# EasyEDA Pro project ProDocument_frontend_2024-01-22.epro

# Schematic Schematic2
Create Date: 2023-08-02; Page Name: P1; Project Name: esp-alarm-clock; Schematic Name: Schematic2; Update Date: 2023-08-02; Company: EasyEDA.com; Drawed: EasyEDA Pro; Page Size: A4; Part Number: JLCPCB-002; Reviewed: EasyEDA Pro; Version: V0.1
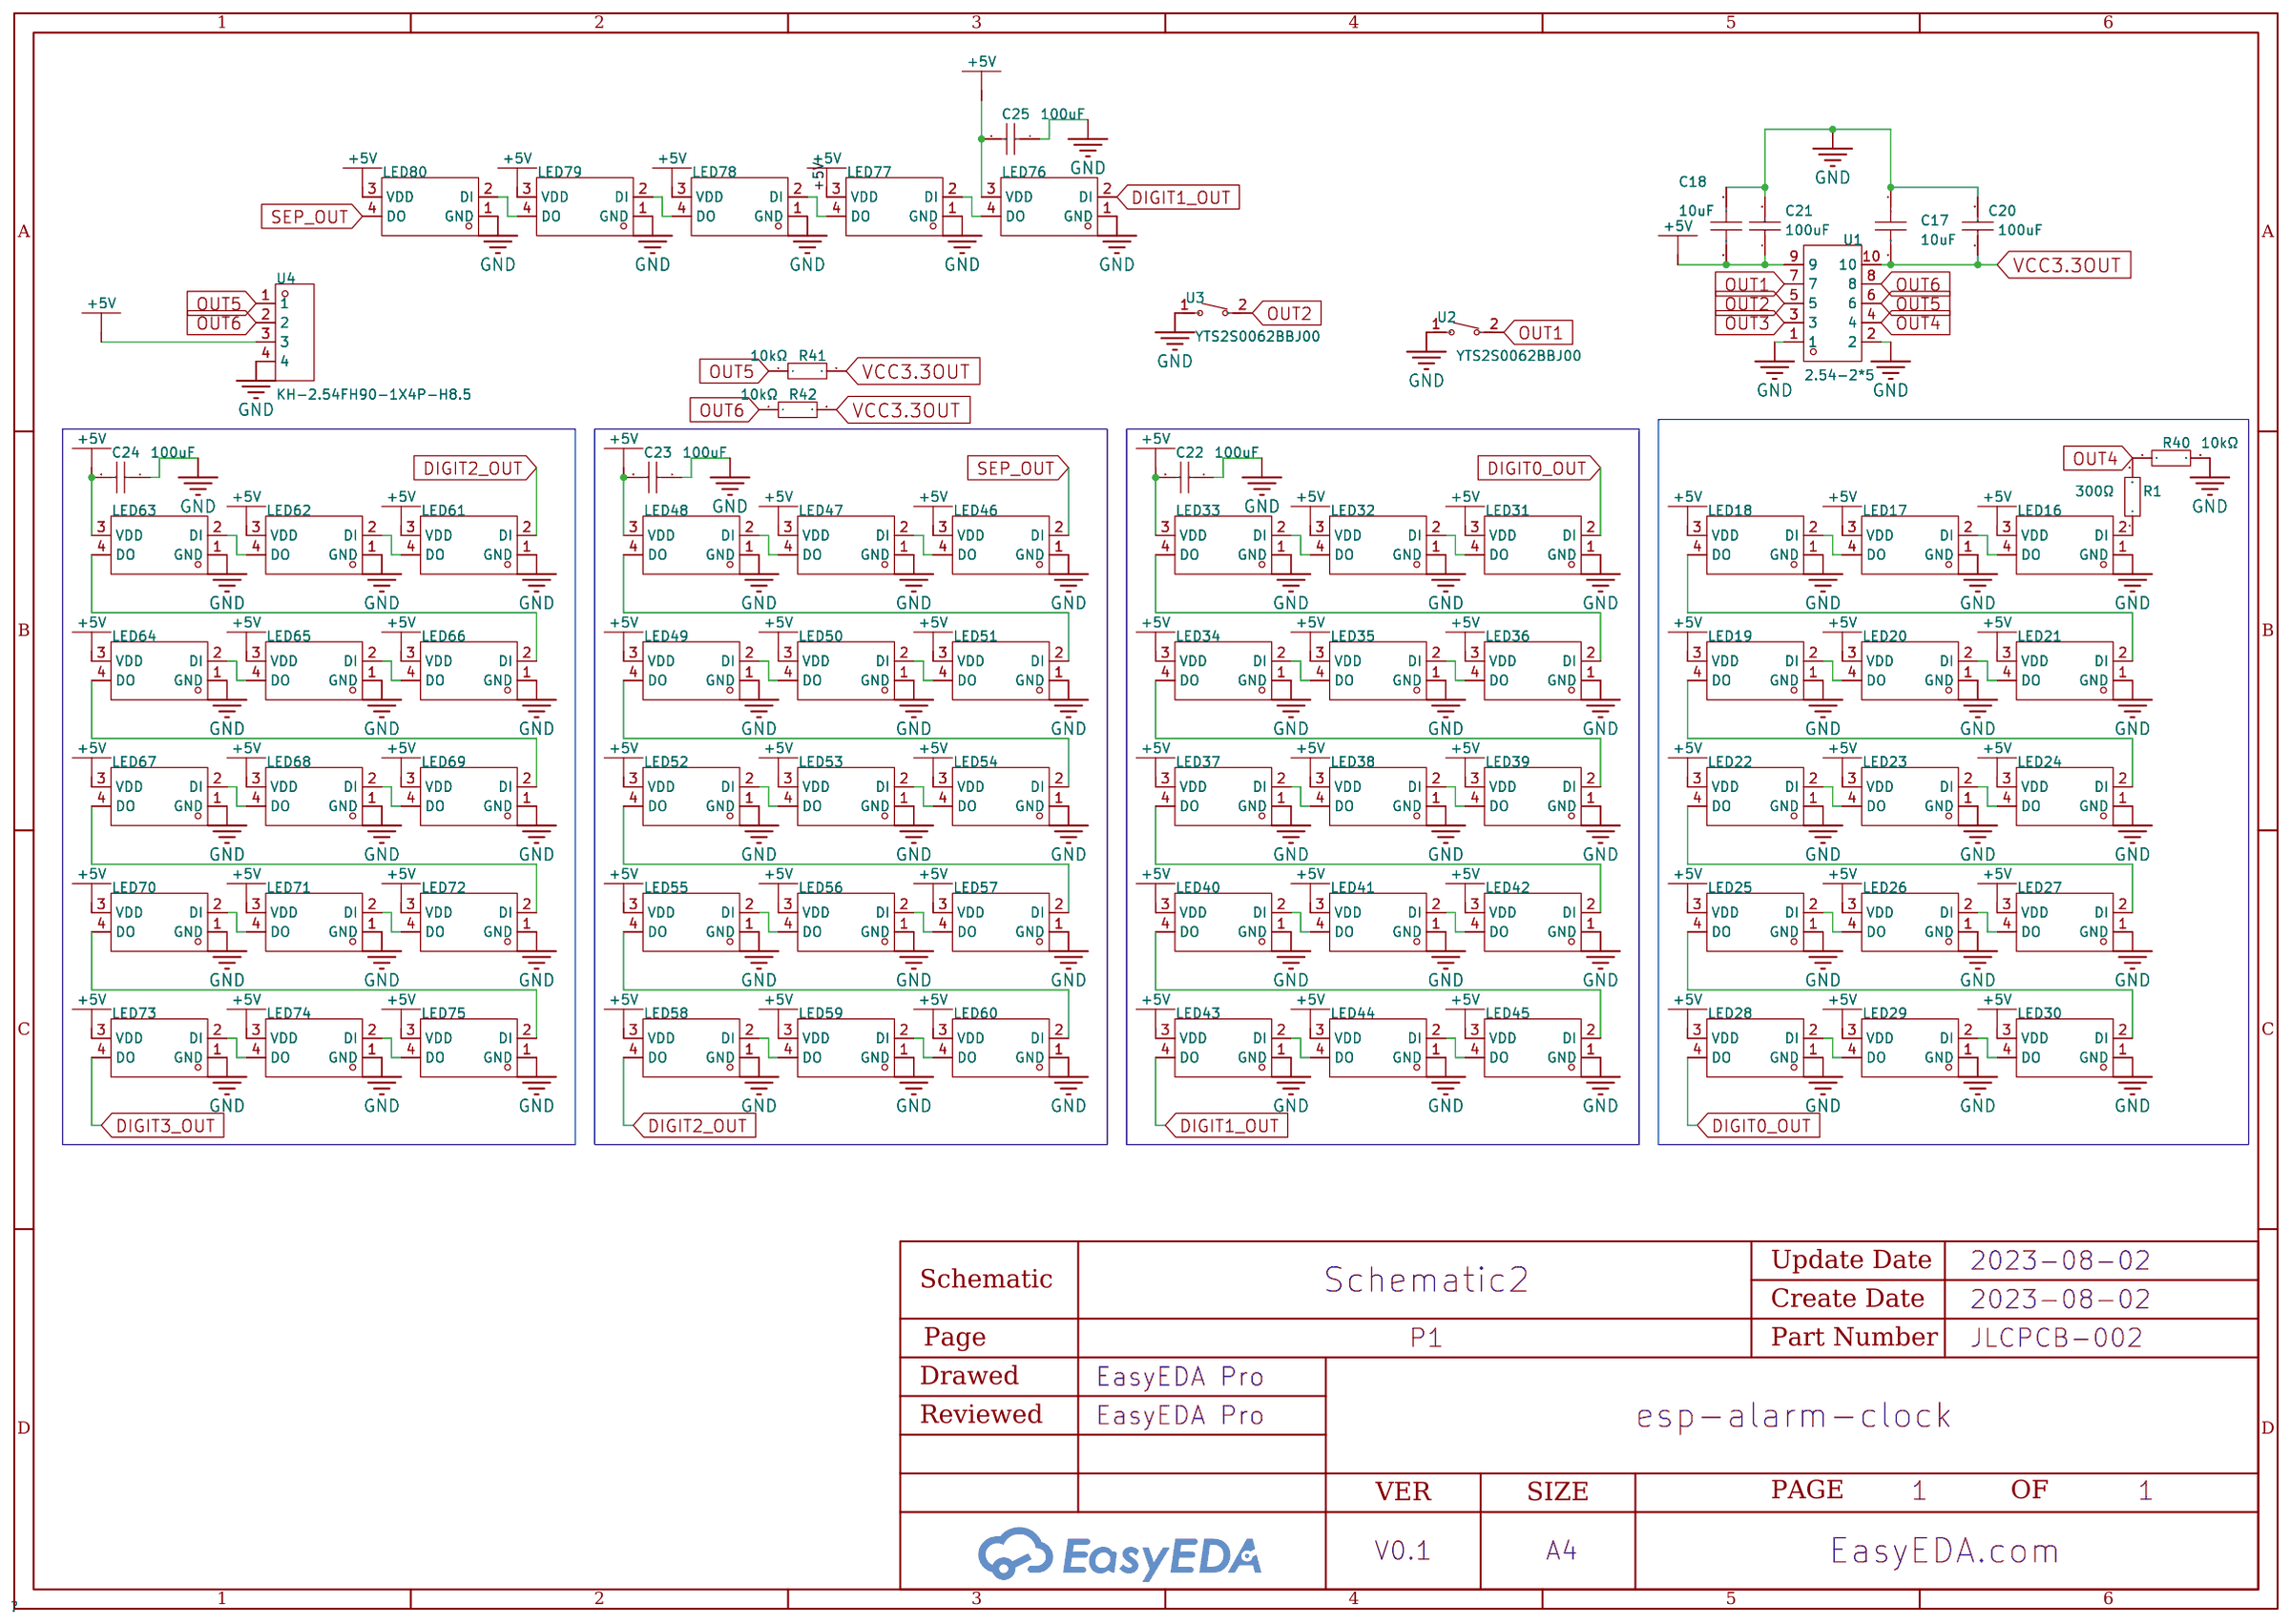
[diagram p0: schematic sheet]

## Parts
C17  10uF  [C0603]
C18  10uF  [C0603]
C20  100uF  [C1206]
C21  100uF  [C1206]
C22  100uF  [C1206]
C23  100uF  [C1206]
C24  100uF  [C1206]
C25  100uF  [C1206]
LED16  XL-3528RGBW-WS2812B  [LED-SMD_4P-L3.5-W2.8-BR-1]
LED17  XL-3528RGBW-WS2812B  [LED-SMD_4P-L3.5-W2.8-BR-1]
LED18  XL-3528RGBW-WS2812B  [LED-SMD_4P-L3.5-W2.8-BR-1]
LED19  XL-3528RGBW-WS2812B  [LED-SMD_4P-L3.5-W2.8-BR-1]
LED20  XL-3528RGBW-WS2812B  [LED-SMD_4P-L3.5-W2.8-BR-1]
LED21  XL-3528RGBW-WS2812B  [LED-SMD_4P-L3.5-W2.8-BR-1]
LED22  XL-3528RGBW-WS2812B  [LED-SMD_4P-L3.5-W2.8-BR-1]
LED23  XL-3528RGBW-WS2812B  [LED-SMD_4P-L3.5-W2.8-BR-1]
LED24  XL-3528RGBW-WS2812B  [LED-SMD_4P-L3.5-W2.8-BR-1]
LED25  XL-3528RGBW-WS2812B  [LED-SMD_4P-L3.5-W2.8-BR-1]
LED26  XL-3528RGBW-WS2812B  [LED-SMD_4P-L3.5-W2.8-BR-1]
LED27  XL-3528RGBW-WS2812B  [LED-SMD_4P-L3.5-W2.8-BR-1]
LED28  XL-3528RGBW-WS2812B  [LED-SMD_4P-L3.5-W2.8-BR-1]
LED29  XL-3528RGBW-WS2812B  [LED-SMD_4P-L3.5-W2.8-BR-1]
LED30  XL-3528RGBW-WS2812B  [LED-SMD_4P-L3.5-W2.8-BR-1]
LED31  XL-3528RGBW-WS2812B  [LED-SMD_4P-L3.5-W2.8-BR-1]
LED32  XL-3528RGBW-WS2812B  [LED-SMD_4P-L3.5-W2.8-BR-1]
LED33  XL-3528RGBW-WS2812B  [LED-SMD_4P-L3.5-W2.8-BR-1]
LED34  XL-3528RGBW-WS2812B  [LED-SMD_4P-L3.5-W2.8-BR-1]
LED35  XL-3528RGBW-WS2812B  [LED-SMD_4P-L3.5-W2.8-BR-1]
LED36  XL-3528RGBW-WS2812B  [LED-SMD_4P-L3.5-W2.8-BR-1]
LED37  XL-3528RGBW-WS2812B  [LED-SMD_4P-L3.5-W2.8-BR-1]
LED38  XL-3528RGBW-WS2812B  [LED-SMD_4P-L3.5-W2.8-BR-1]
LED39  XL-3528RGBW-WS2812B  [LED-SMD_4P-L3.5-W2.8-BR-1]
LED40  XL-3528RGBW-WS2812B  [LED-SMD_4P-L3.5-W2.8-BR-1]
LED41  XL-3528RGBW-WS2812B  [LED-SMD_4P-L3.5-W2.8-BR-1]
LED42  XL-3528RGBW-WS2812B  [LED-SMD_4P-L3.5-W2.8-BR-1]
LED43  XL-3528RGBW-WS2812B  [LED-SMD_4P-L3.5-W2.8-BR-1]
LED44  XL-3528RGBW-WS2812B  [LED-SMD_4P-L3.5-W2.8-BR-1]
LED45  XL-3528RGBW-WS2812B  [LED-SMD_4P-L3.5-W2.8-BR-1]
LED46  XL-3528RGBW-WS2812B  [LED-SMD_4P-L3.5-W2.8-BR-1]
LED47  XL-3528RGBW-WS2812B  [LED-SMD_4P-L3.5-W2.8-BR-1]
LED48  XL-3528RGBW-WS2812B  [LED-SMD_4P-L3.5-W2.8-BR-1]
LED49  XL-3528RGBW-WS2812B  [LED-SMD_4P-L3.5-W2.8-BR-1]
LED50  XL-3528RGBW-WS2812B  [LED-SMD_4P-L3.5-W2.8-BR-1]
LED51  XL-3528RGBW-WS2812B  [LED-SMD_4P-L3.5-W2.8-BR-1]
LED52  XL-3528RGBW-WS2812B  [LED-SMD_4P-L3.5-W2.8-BR-1]
LED53  XL-3528RGBW-WS2812B  [LED-SMD_4P-L3.5-W2.8-BR-1]
LED54  XL-3528RGBW-WS2812B  [LED-SMD_4P-L3.5-W2.8-BR-1]
LED55  XL-3528RGBW-WS2812B  [LED-SMD_4P-L3.5-W2.8-BR-1]
LED56  XL-3528RGBW-WS2812B  [LED-SMD_4P-L3.5-W2.8-BR-1]
LED57  XL-3528RGBW-WS2812B  [LED-SMD_4P-L3.5-W2.8-BR-1]
LED58  XL-3528RGBW-WS2812B  [LED-SMD_4P-L3.5-W2.8-BR-1]
LED59  XL-3528RGBW-WS2812B  [LED-SMD_4P-L3.5-W2.8-BR-1]
LED60  XL-3528RGBW-WS2812B  [LED-SMD_4P-L3.5-W2.8-BR-1]
LED61  XL-3528RGBW-WS2812B  [LED-SMD_4P-L3.5-W2.8-BR-1]
LED62  XL-3528RGBW-WS2812B  [LED-SMD_4P-L3.5-W2.8-BR-1]
LED63  XL-3528RGBW-WS2812B  [LED-SMD_4P-L3.5-W2.8-BR-1]
LED64  XL-3528RGBW-WS2812B  [LED-SMD_4P-L3.5-W2.8-BR-1]
LED65  XL-3528RGBW-WS2812B  [LED-SMD_4P-L3.5-W2.8-BR-1]
LED66  XL-3528RGBW-WS2812B  [LED-SMD_4P-L3.5-W2.8-BR-1]
LED67  XL-3528RGBW-WS2812B  [LED-SMD_4P-L3.5-W2.8-BR-1]
LED68  XL-3528RGBW-WS2812B  [LED-SMD_4P-L3.5-W2.8-BR-1]
LED69  XL-3528RGBW-WS2812B  [LED-SMD_4P-L3.5-W2.8-BR-1]
LED70  XL-3528RGBW-WS2812B  [LED-SMD_4P-L3.5-W2.8-BR-1]
LED71  XL-3528RGBW-WS2812B  [LED-SMD_4P-L3.5-W2.8-BR-1]
LED72  XL-3528RGBW-WS2812B  [LED-SMD_4P-L3.5-W2.8-BR-1]
LED73  XL-3528RGBW-WS2812B  [LED-SMD_4P-L3.5-W2.8-BR-1]
LED74  XL-3528RGBW-WS2812B  [LED-SMD_4P-L3.5-W2.8-BR-1]
LED75  XL-3528RGBW-WS2812B  [LED-SMD_4P-L3.5-W2.8-BR-1]
LED76  XL-3528RGBW-WS2812B  [LED-SMD_4P-L3.5-W2.8-BR-1]
LED77  XL-3528RGBW-WS2812B  [LED-SMD_4P-L3.5-W2.8-BR-1]
LED78  XL-3528RGBW-WS2812B  [LED-SMD_4P-L3.5-W2.8-BR-1]
LED79  XL-3528RGBW-WS2812B  [LED-SMD_4P-L3.5-W2.8-BR-1]
LED80  XL-3528RGBW-WS2812B  [LED-SMD_4P-L3.5-W2.8-BR-1]
R1  300Ω  [R0603]
R40  10kΩ  [R0603]
R41  10kΩ  [R0603]
R42  10kΩ  [R0603]
U1  2.54-2*5  [HDR-TH_10P-P2.54-V-F-R2-C5-S2.54]
U2  YTS2S0062BBJ00  [KEY-SMD_L6.0-W6.0-LS6.6]
U3  YTS2S0062BBJ00  [KEY-SMD_L6.0-W6.0-LS6.6]
U4  KH-2.54FH90-1X4P-H8.5  [HDR-TH_4P-P2.54-H-F-W10.2]

## Library data of the parts
C17 C18 = TCC0603X5R106M6R3CT: Capacitance: Tolerance: Tolerance: Voltage Rated: Temperature Coefficient:; LCSC Part Name: 10uF ±20% 6.3V; Supplier Part: C380318; Manufacturer: CCTC(三环); Supplier Footprint: 0603; JLCPCB Part Class: Extended Part; Datasheet: https://atta.szlcsc.com/upload/public/pdf/source/20190322/C380318_4888396533DC2EE276525D3FA01190AE.pdf; Supplier: LCSC
C20-C25 = CL31A107MQHNNNE: Capacitance: Tolerance:±20% Tolerance:±20% Voltage Rated: Temperature Coefficient:; LCSC Part Name: 100uF ±20% 6.3V; Supplier Part: C15008; Manufacturer: SAMSUNG(三星); Supplier Footprint: 1206; JLCPCB Part Class: Basic Part; Datasheet: https://atta.szlcsc.com/upload/public/pdf/source/20160103/1457707673200.pdf; Supplier: LCSC; Tolerance: ±20%
LED16-LED80 = XL-3528RGBW-WS2812B: Emitted Color:RGB Diode Configuration:- Dominant Wavelength:618nm~623nm；520nm~525nm；467nm~472nm Dominant Wavelength:618nm~623nm；520nm~525nm；467nm~472nm Peak Wavelength:525nm；623nm；472nm Forward Current:20mA Power Dissipation:50mW；50mW；45mW Viewing Angle:1; LCSC Part Name: RGB三色 正贴 幻彩; Supplier Part: C2890364; Manufacturer: XINGLIGHT(成兴光); Supplier Footprint: SMD3528-4P; JLCPCB Part Class: Extended Part; Datasheet: https://atta.szlcsc.com/upload/public/pdf/source/20221102/50F456983F591359B0D81AA557777463.pdf; Supplier: LCSC; Emitted Color: RGB; Dominant Wavelength: 618nm~623nm；520nm~525nm；467nm~472nm; Peak Wavelength: 525nm；623nm；472nm; Forward Current: 20mA; Power Dissipation: 50mW；50mW；45mW; Viewing Angle: 120°; Mounting Sytle: Positive post; Operating Temperature: -25℃~+80℃
R1 = 0603WAF3000T5E: Type:Thick Film Resistors Resistance: Tolerance:±1% Tolerance:±1% Power(Watts): Temperature Coefficient:±100ppm/℃ Temperature Coefficient:±100ppm/℃ Overload Voltage (Max): Operating Temperature Range:-55℃~+155℃ Operating Temperature Range:-55℃~+155℃; LCSC Part Name: 300Ω ±1% 100mW; Supplier Part: C23025; Manufacturer: UNI-ROYAL(厚声); Supplier Footprint: 0603; JLCPCB Part Class: Basic Part; Datasheet: https://atta.szlcsc.com/upload/public/pdf/source/20200306/C422600_1E6D84923E4A46A82E41ADD87F860B5C.pdf; Supplier: LCSC; Type: Thick Film Resistors; Tolerance: ±1%; Temperature Coefficient: ±100ppm/℃; Operating Temperature Range: -55℃~+155℃
R40-R42 = RC0603FR-0710KL: Type:Thick Film Resistors Resistance: Tolerance:±1% Tolerance:±1% Power(Watts): Temperature Coefficient:±100ppm/℃ Temperature Coefficient:±100ppm/℃ Overload Voltage (Max): Operating Temperature Range:-55℃~+155℃ Operating Temperature Range:-55℃~+155℃; LCSC Part Name: 10kΩ ±1% 100mW; Supplier Part: C98220; Manufacturer: YAGEO(国巨); Supplier Footprint: 0603; JLCPCB Part Class: Extended Part; Datasheet: https://atta.szlcsc.com/upload/public/pdf/source/20170522/1495423494387.pdf; Supplier: LCSC; Type: Thick Film Resistors; Tolerance: ±1%; Temperature Coefficient: ±100ppm/℃; Operating Temperature Range: -55℃~+155℃
U1 = 2.54-2*5: Number of Rows:双排 Number of Holes:10 Pitch:2.54mm Holes Structure:2x5P Row Spacing:2.54mm Mounting Type:Straight Circular Hole / Square Hole:Square Holes Current Rating (Max):2.5A Voltage Rating (Max):- Holes Direction:Top Insulation Height:8.5mm Operatin; LCSC Part Name: 2.54mm 2x5P; Supplier Part: C2977587; Manufacturer: ZHOURI(洲日); Supplier Footprint: 插件,P=2.54mm; JLCPCB Part Class: Extended Part; Supplier: LCSC; Number of Rows: 双排; Number of Holes: 10; Pitch: 2.54mm; Holes Structure: 2x5P; Row Spacing: 2.54mm; Mounting Type: Straight; Circular Hole / Square Hole: Square Holes; Current Rating (Max): 2.5A; Holes Direction: Top; Insulation Height: 8.5mm; Operating Temperature Range: -40℃~+105℃
U2 U3 = YTS2S0062BBJ00: Operating Force:200gf Switch Length:6mm Switch Width:6mm Switch Height:5mm; LCSC Part Name: 6x6X5.0 200gf无声按键 轻触开关; Supplier Part: C5260485; Manufacturer: YIYUAN(怡远); Supplier Footprint: SMD; JLCPCB Part Class: Extended Part; Datasheet: https://atta.szlcsc.com/upload/public/pdf/source/20221115/9AA6C284B5850DDA84F65000856CABE8.pdf; Supplier: LCSC; Operating Force: 200gf; Switch Length: 6mm; Switch Width: 6mm; Switch Height: 5mm
U4 = KH-2.54FH90-1X4P-H8.5: Number of Rows:Plugin Number of Holes:4P Pitch:2.54mm Holes Structure:1x4P Row Spacing:- Mounting Type:Shrouded Circular Hole / Square Hole:Square Holes Current Rating (Max):3A Voltage Rating (Max):- Holes Direction:side Insulation Height:8.5mm Operating; LCSC Part Name: 2.54mm 1x4P; Supplier Part: C2932680; Manufacturer: kinghelm(金航标); Supplier Footprint: 弯插,P=2.54mm; JLCPCB Part Class: Extended Part; Datasheet: https://atta.szlcsc.com/upload/public/pdf/source/20211220/B697AF7E5D3EB74EDD88E765A3544EAB.pdf; Supplier: LCSC; Number of Rows: Plugin; Number of Holes: 4P; Pitch: 2.54mm; Holes Structure: 1x4P; Mounting Type: Shrouded; Circular Hole / Square Hole: Square Holes; Current Rating (Max): 3A; Holes Direction: side; Insulation Height: 8.5mm; Operating Temperature Range: -40℃~+105℃

## Nets
+5V: C18.2 C21.1 C22.2 C23.2 C24.2 C25.2 LED16.3(VDD) LED17.3(VDD) LED18.3(VDD) LED19.3(VDD) LED20.3(VDD) LED21.3(VDD) LED22.3(VDD) LED23.3(VDD) LED24.3(VDD) LED25.3(VDD) LED26.3(VDD) LED27.3(VDD) LED28.3(VDD) LED29.3(VDD) LED30.3(VDD) LED31.3(VDD) LED32.3(VDD) LED33.3(VDD) LED34.3(VDD) LED35.3(VDD) LED36.3(VDD) LED37.3(VDD) LED38.3(VDD) LED39.3(VDD) LED40.3(VDD) LED41.3(VDD) LED42.3(VDD) LED43.3(VDD) LED44.3(VDD) LED45.3(VDD) LED46.3(VDD) LED47.3(VDD) LED48.3(VDD) LED49.3(VDD) LED50.3(VDD) LED51.3(VDD) LED52.3(VDD) LED53.3(VDD) LED54.3(VDD) LED55.3(VDD) LED56.3(VDD) LED57.3(VDD) LED58.3(VDD) LED59.3(VDD) LED60.3(VDD) LED61.3(VDD) LED62.3(VDD) LED63.3(VDD) LED64.3(VDD) LED65.3(VDD) LED66.3(VDD) LED67.3(VDD) LED68.3(VDD) LED69.3(VDD) LED70.3(VDD) LED71.3(VDD) LED72.3(VDD) LED73.3(VDD) LED74.3(VDD) LED75.3(VDD) LED76.3(VDD) LED77.3(VDD) LED78.3(VDD) LED79.3(VDD) LED80.3(VDD) U1.9 U4.3
GND: C17.1 C18.1 C20.2 C21.2 C22.1 C23.1 C24.1 C25.1 LED16.1(GND) LED17.1(GND) LED18.1(GND) LED19.1(GND) LED20.1(GND) LED21.1(GND) LED22.1(GND) LED23.1(GND) LED24.1(GND) LED25.1(GND) LED26.1(GND) LED27.1(GND) LED28.1(GND) LED29.1(GND) LED30.1(GND) LED31.1(GND) LED32.1(GND) LED33.1(GND) LED34.1(GND) LED35.1(GND) LED36.1(GND) LED37.1(GND) LED38.1(GND) LED39.1(GND) LED40.1(GND) LED41.1(GND) LED42.1(GND) LED43.1(GND) LED44.1(GND) LED45.1(GND) LED46.1(GND) LED47.1(GND) LED48.1(GND) LED49.1(GND) LED50.1(GND) LED51.1(GND) LED52.1(GND) LED53.1(GND) LED54.1(GND) LED55.1(GND) LED56.1(GND) LED57.1(GND) LED58.1(GND) LED59.1(GND) LED60.1(GND) LED61.1(GND) LED62.1(GND) LED63.1(GND) LED64.1(GND) LED65.1(GND) LED66.1(GND) LED67.1(GND) LED68.1(GND) LED69.1(GND) LED70.1(GND) LED71.1(GND) LED72.1(GND) LED73.1(GND) LED74.1(GND) LED75.1(GND) LED76.1(GND) LED77.1(GND) LED78.1(GND) LED79.1(GND) LED80.1(GND) R40.2 U1.1 U1.2 U2.1(A) U3.1(A) U4.4
VCC3.3OUT: C17.2 C20.1 R41.2 R42.2 U1.10
DIGIT0_OUT: LED28.4(DO) LED31.2(DI)
DIGIT1_OUT: LED43.4(DO) LED76.2(DI)
DIGIT2_OUT: LED58.4(DO) LED61.2(DI)
DIGIT3_OUT: LED73.4(DO)
OUT1: U1.7 U2.2(B)
OUT2: U1.5 U3.2(B)
OUT3: U1.3
OUT4: R1.2 R40.1 U1.4
OUT5: R41.1 U1.6 U4.1
OUT6: R42.1 U1.8 U4.2
SEP_OUT: LED46.2(DI) LED80.4(DO)
$1N492: LED16.4(DO) LED17.2(DI)
$1N566: LED17.4(DO) LED18.2(DI)
$1N842: LED20.2(DI) LED21.4(DO)
$1N846: LED19.2(DI) LED20.4(DO)
$1N1059: LED23.2(DI) LED24.4(DO)
$1N1063: LED22.2(DI) LED23.4(DO)
$1N1276: LED26.2(DI) LED27.4(DO)
$1N1280: LED25.2(DI) LED26.4(DO)
$1N1499: LED29.2(DI) LED30.4(DO)
$1N1503: LED28.2(DI) LED29.4(DO)
$1N1526: LED18.4(DO) LED21.2(DI)
$1N1531: LED19.4(DO) LED24.2(DI)
$1N1536: LED22.4(DO) LED27.2(DI)
$1N1541: LED25.4(DO) LED30.2(DI)
$1N5237: LED16.2(DI) R1.1
$1N7053: LED31.4(DO) LED32.2(DI)
$1N7057: LED32.4(DO) LED33.2(DI)
$1N7061: LED35.2(DI) LED36.4(DO)
$1N7065: LED34.2(DI) LED35.4(DO)
$1N7069: LED38.2(DI) LED39.4(DO)
$1N7073: LED37.2(DI) LED38.4(DO)
$1N7077: LED41.2(DI) LED42.4(DO)
$1N7081: LED40.2(DI) LED41.4(DO)
$1N7085: LED44.2(DI) LED45.4(DO)
$1N7089: LED43.2(DI) LED44.4(DO)
$1N7093: LED33.4(DO) LED36.2(DI)
$1N7097: LED34.4(DO) LED39.2(DI)
$1N7101: LED37.4(DO) LED42.2(DI)
$1N7105: LED40.4(DO) LED45.2(DI)
$1N8208: LED46.4(DO) LED47.2(DI)
$1N8212: LED47.4(DO) LED48.2(DI)
$1N8216: LED50.2(DI) LED51.4(DO)
$1N8220: LED49.2(DI) LED50.4(DO)
$1N8224: LED53.2(DI) LED54.4(DO)
$1N8228: LED52.2(DI) LED53.4(DO)
$1N8232: LED56.2(DI) LED57.4(DO)
$1N8236: LED55.2(DI) LED56.4(DO)
$1N8240: LED59.2(DI) LED60.4(DO)
$1N8244: LED58.2(DI) LED59.4(DO)
$1N8248: LED48.4(DO) LED51.2(DI)
$1N8252: LED49.4(DO) LED54.2(DI)
$1N8256: LED52.4(DO) LED57.2(DI)
$1N8260: LED55.4(DO) LED60.2(DI)
$1N9308: LED61.4(DO) LED62.2(DI)
$1N9312: LED62.4(DO) LED63.2(DI)
$1N9316: LED65.2(DI) LED66.4(DO)
$1N9320: LED64.2(DI) LED65.4(DO)
$1N9324: LED68.2(DI) LED69.4(DO)
$1N9328: LED67.2(DI) LED68.4(DO)
$1N9332: LED71.2(DI) LED72.4(DO)
$1N9336: LED70.2(DI) LED71.4(DO)
$1N9340: LED74.2(DI) LED75.4(DO)
$1N9344: LED73.2(DI) LED74.4(DO)
$1N9348: LED63.4(DO) LED66.2(DI)
$1N9352: LED64.4(DO) LED69.2(DI)
$1N9356: LED67.4(DO) LED72.2(DI)
$1N9360: LED70.4(DO) LED75.2(DI)
$1N9683: LED76.4(DO) LED77.2(DI)
$1N9693: LED77.4(DO) LED78.2(DI)
$1N9887: LED78.4(DO) LED79.2(DI)
$1N9959: LED79.4(DO) LED80.2(DI)

# Board PCB4
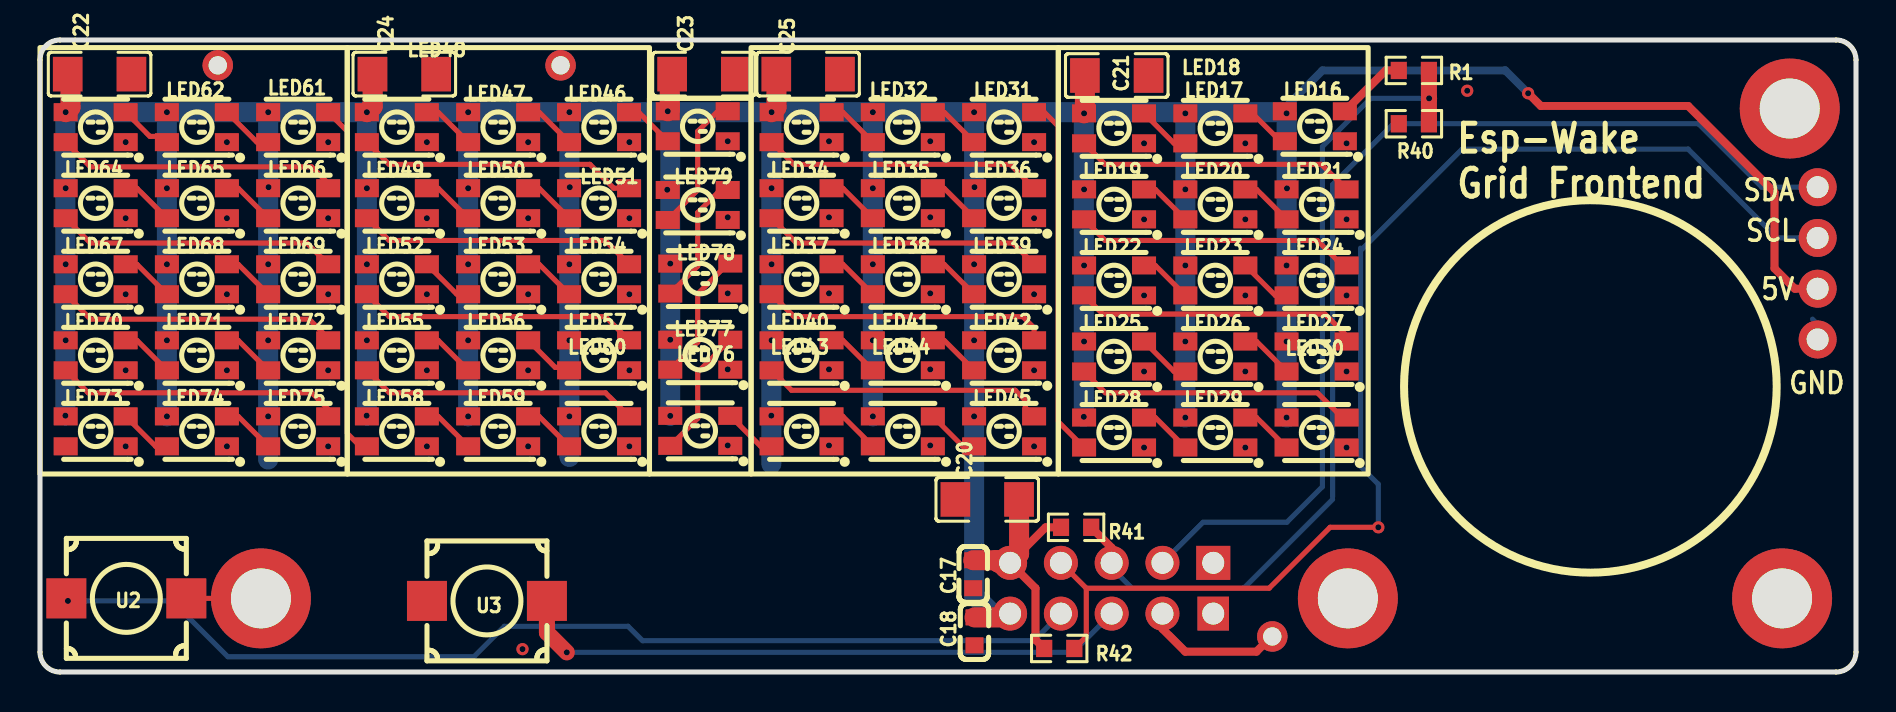
[diagram p1: board, top side]
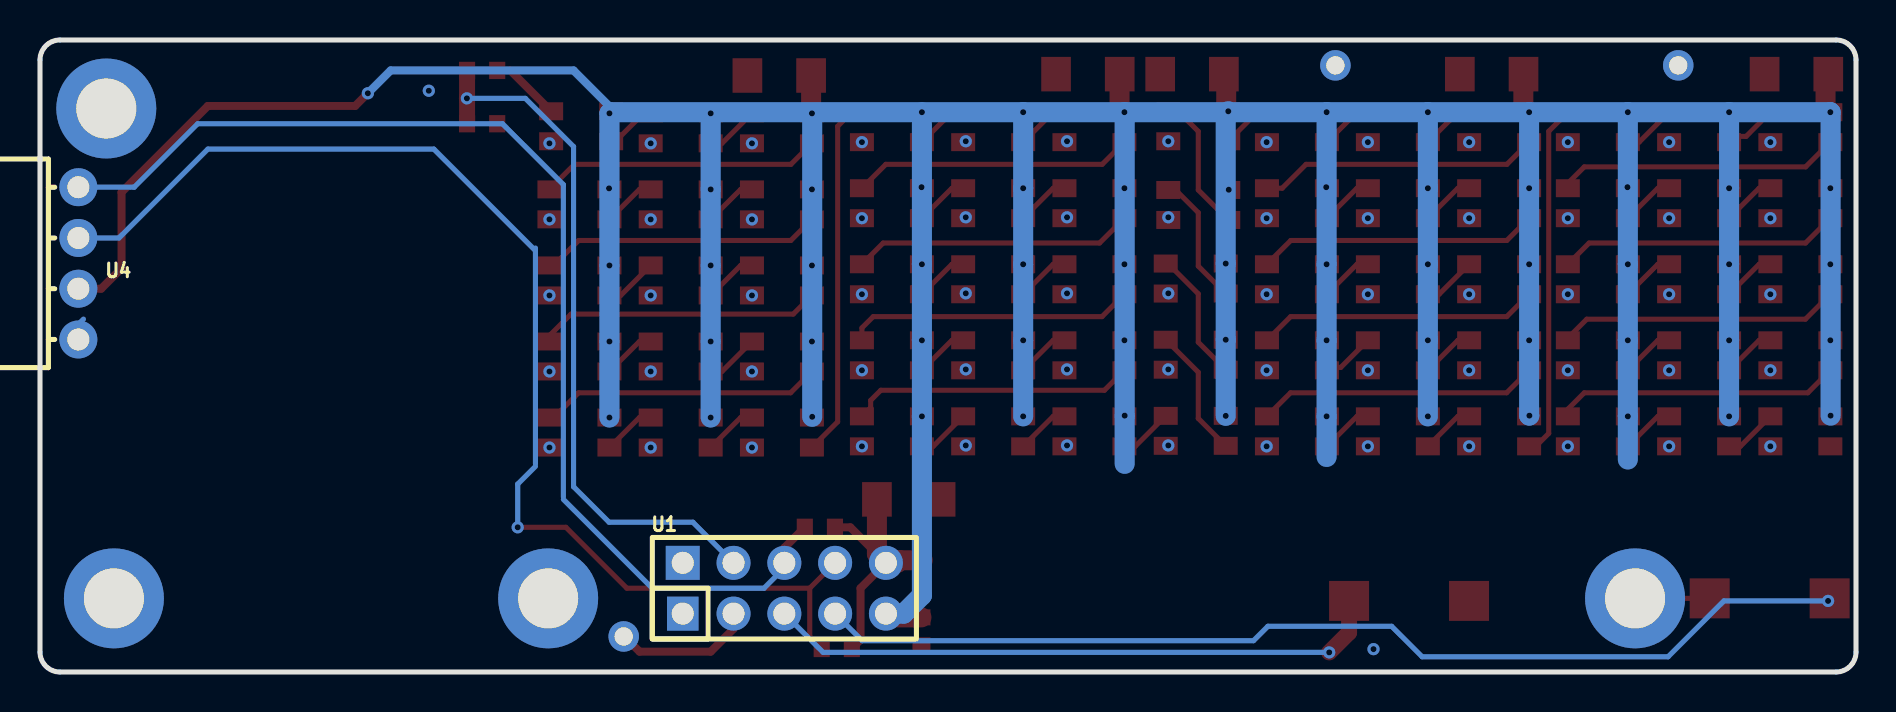
[diagram p2: board, bottom side, seen from below]

Outline 90.82 x 31.62 mm; copper layers: Top Layer, Bottom Layer. Coordinates in mm from the lower left corner of the outline.
Outline path: 0,30.62 0,1 arc(0.29,0.29) 1,0 89.82,0 arc(90.53,0.29) 90.82,1 90.82,30.62 arc(90.53,31.33) 89.82,31.62 1,31.62 arc(0.29,31.33) 0,30.62
Stack: Top Layer 0.035mm / Dielectric1 1.51mm FR4 er 4.5 / Bottom Layer 0.035mm

## Design rules (mm)
template: JLCPCB Capability(Two Layers Board)
spacing copperThickness1oz (default): track to track 0.102, other pairs 0.152 to 0.3
spacing copperThickness2oz: track to track 0.203, other pairs 0.152 to 0.3
track width copperThickness1oz (default): min 0.127, default 0.254, max 2.54
track width copperThickness2oz: min 0.203, default 0.254, max 2.54
differential pair differentialPair (default): width min 0.127, default 0.254, max 2.54; gap min 0.152, default 0.152
via viaSize (default): diameter min 0.5, default 0.61, max 10; hole min 0.3, default 0.305, max 6.3

## Placement (name value [footprint] x y rotation side)
C17  10uF  [C0603]  46.67 4.89 90 top
C18  10uF  [C0603]  46.74 2.03 90 top
C20  100uF  [C1206]  47.37 8.64 180 top
C21  100uF  [C1206]  53.85 29.85 0 top
C22  100uF  [C1206]  2.98 29.92 180 top
C23  100uF  [C1206]  33.21 29.92 180 top
C24  100uF  [C1206]  18.22 29.92 180 top
C25  100uF  [C1206]  38.41 29.92 180 top
LED16  XL-3528RGBW-WS2812B  [LED-SMD_4P-L3.5-W2.8-BR-1]  63.75 27.31 0 top
LED17  XL-3528RGBW-WS2812B  [LED-SMD_4P-L3.5-W2.8-BR-1]  58.78 27.2 0 top
LED18  XL-3528RGBW-WS2812B  [LED-SMD_4P-L3.5-W2.8-BR-1]  53.71 27.2 0 top
LED19  XL-3528RGBW-WS2812B  [LED-SMD_4P-L3.5-W2.8-BR-1]  53.71 23.4 0 top
LED20  XL-3528RGBW-WS2812B  [LED-SMD_4P-L3.5-W2.8-BR-1]  58.78 23.4 0 top
LED21  XL-3528RGBW-WS2812B  [LED-SMD_4P-L3.5-W2.8-BR-1]  63.84 23.4 0 top
LED22  XL-3528RGBW-WS2812B  [LED-SMD_4P-L3.5-W2.8-BR-1]  53.71 19.59 0 top
LED23  XL-3528RGBW-WS2812B  [LED-SMD_4P-L3.5-W2.8-BR-1]  58.78 19.59 0 top
LED24  XL-3528RGBW-WS2812B  [LED-SMD_4P-L3.5-W2.8-BR-1]  63.84 19.59 0 top
LED25  XL-3528RGBW-WS2812B  [LED-SMD_4P-L3.5-W2.8-BR-1]  53.71 15.79 0 top
LED26  XL-3528RGBW-WS2812B  [LED-SMD_4P-L3.5-W2.8-BR-1]  58.78 15.79 0 top
LED27  XL-3528RGBW-WS2812B  [LED-SMD_4P-L3.5-W2.8-BR-1]  63.84 15.79 0 top
LED28  XL-3528RGBW-WS2812B  [LED-SMD_4P-L3.5-W2.8-BR-1]  53.71 11.98 0 top
LED29  XL-3528RGBW-WS2812B  [LED-SMD_4P-L3.5-W2.8-BR-1]  58.78 11.98 0 top
LED30  XL-3528RGBW-WS2812B  [LED-SMD_4P-L3.5-W2.8-BR-1]  63.84 11.98 0 top
LED31  XL-3528RGBW-WS2812B  [LED-SMD_4P-L3.5-W2.8-BR-1]  48.21 27.26 0 top
LED32  XL-3528RGBW-WS2812B  [LED-SMD_4P-L3.5-W2.8-BR-1]  43.15 27.26 0 top
LED33  XL-3528RGBW-WS2812B  [LED-SMD_4P-L3.5-W2.8-BR-1]  38.09 27.26 0 top
LED34  XL-3528RGBW-WS2812B  [LED-SMD_4P-L3.5-W2.8-BR-1]  38.09 23.46 0 top
LED35  XL-3528RGBW-WS2812B  [LED-SMD_4P-L3.5-W2.8-BR-1]  43.15 23.46 0 top
LED36  XL-3528RGBW-WS2812B  [LED-SMD_4P-L3.5-W2.8-BR-1]  48.21 23.46 0 top
LED37  XL-3528RGBW-WS2812B  [LED-SMD_4P-L3.5-W2.8-BR-1]  38.09 19.65 0 top
LED38  XL-3528RGBW-WS2812B  [LED-SMD_4P-L3.5-W2.8-BR-1]  43.15 19.65 0 top
LED39  XL-3528RGBW-WS2812B  [LED-SMD_4P-L3.5-W2.8-BR-1]  48.21 19.65 0 top
LED40  XL-3528RGBW-WS2812B  [LED-SMD_4P-L3.5-W2.8-BR-1]  38.09 15.85 0 top
LED41  XL-3528RGBW-WS2812B  [LED-SMD_4P-L3.5-W2.8-BR-1]  43.15 15.85 0 top
LED42  XL-3528RGBW-WS2812B  [LED-SMD_4P-L3.5-W2.8-BR-1]  48.21 15.85 0 top
LED43  XL-3528RGBW-WS2812B  [LED-SMD_4P-L3.5-W2.8-BR-1]  38.09 12.04 0 top
LED44  XL-3528RGBW-WS2812B  [LED-SMD_4P-L3.5-W2.8-BR-1]  43.15 12.04 0 top
LED45  XL-3528RGBW-WS2812B  [LED-SMD_4P-L3.5-W2.8-BR-1]  48.21 12.04 0 top
LED46  XL-3528RGBW-WS2812B  [LED-SMD_4P-L3.5-W2.8-BR-1]  27.96 27.26 0 top
LED47  XL-3528RGBW-WS2812B  [LED-SMD_4P-L3.5-W2.8-BR-1]  22.91 27.26 0 top
LED48  XL-3528RGBW-WS2812B  [LED-SMD_4P-L3.5-W2.8-BR-1]  17.85 27.26 0 top
LED49  XL-3528RGBW-WS2812B  [LED-SMD_4P-L3.5-W2.8-BR-1]  17.85 23.46 0 top
LED50  XL-3528RGBW-WS2812B  [LED-SMD_4P-L3.5-W2.8-BR-1]  22.91 23.46 0 top
LED51  XL-3528RGBW-WS2812B  [LED-SMD_4P-L3.5-W2.8-BR-1]  27.96 23.46 0 top
LED52  XL-3528RGBW-WS2812B  [LED-SMD_4P-L3.5-W2.8-BR-1]  17.85 19.65 0 top
LED53  XL-3528RGBW-WS2812B  [LED-SMD_4P-L3.5-W2.8-BR-1]  22.91 19.65 0 top
LED54  XL-3528RGBW-WS2812B  [LED-SMD_4P-L3.5-W2.8-BR-1]  27.96 19.65 0 top
LED55  XL-3528RGBW-WS2812B  [LED-SMD_4P-L3.5-W2.8-BR-1]  17.85 15.85 0 top
LED56  XL-3528RGBW-WS2812B  [LED-SMD_4P-L3.5-W2.8-BR-1]  22.91 15.85 0 top
LED57  XL-3528RGBW-WS2812B  [LED-SMD_4P-L3.5-W2.8-BR-1]  27.96 15.85 0 top
LED58  XL-3528RGBW-WS2812B  [LED-SMD_4P-L3.5-W2.8-BR-1]  17.85 12.04 0 top
LED59  XL-3528RGBW-WS2812B  [LED-SMD_4P-L3.5-W2.8-BR-1]  22.91 12.04 0 top
LED60  XL-3528RGBW-WS2812B  [LED-SMD_4P-L3.5-W2.8-BR-1]  27.96 12.04 0 top
LED61  XL-3528RGBW-WS2812B  [LED-SMD_4P-L3.5-W2.8-BR-1]  12.91 27.26 0 top
LED62  XL-3528RGBW-WS2812B  [LED-SMD_4P-L3.5-W2.8-BR-1]  7.85 27.26 0 top
LED63  XL-3528RGBW-WS2812B  [LED-SMD_4P-L3.5-W2.8-BR-1]  2.78 27.26 0 top
LED64  XL-3528RGBW-WS2812B  [LED-SMD_4P-L3.5-W2.8-BR-1]  2.78 23.46 0 top
LED65  XL-3528RGBW-WS2812B  [LED-SMD_4P-L3.5-W2.8-BR-1]  7.85 23.46 0 top
LED66  XL-3528RGBW-WS2812B  [LED-SMD_4P-L3.5-W2.8-BR-1]  12.91 23.46 0 top
LED67  XL-3528RGBW-WS2812B  [LED-SMD_4P-L3.5-W2.8-BR-1]  2.78 19.65 0 top
LED68  XL-3528RGBW-WS2812B  [LED-SMD_4P-L3.5-W2.8-BR-1]  7.85 19.65 0 top
LED69  XL-3528RGBW-WS2812B  [LED-SMD_4P-L3.5-W2.8-BR-1]  12.91 19.65 0 top
LED70  XL-3528RGBW-WS2812B  [LED-SMD_4P-L3.5-W2.8-BR-1]  2.78 15.85 0 top
LED71  XL-3528RGBW-WS2812B  [LED-SMD_4P-L3.5-W2.8-BR-1]  7.85 15.85 0 top
LED72  XL-3528RGBW-WS2812B  [LED-SMD_4P-L3.5-W2.8-BR-1]  12.91 15.85 0 top
LED73  XL-3528RGBW-WS2812B  [LED-SMD_4P-L3.5-W2.8-BR-1]  2.78 12.04 0 top
LED74  XL-3528RGBW-WS2812B  [LED-SMD_4P-L3.5-W2.8-BR-1]  7.85 12.04 0 top
LED75  XL-3528RGBW-WS2812B  [LED-SMD_4P-L3.5-W2.8-BR-1]  12.91 12.04 0 top
LED76  XL-3528RGBW-WS2812B  [LED-SMD_4P-L3.5-W2.8-BR-1]  33.02 12.07 0 top
LED77  XL-3528RGBW-WS2812B  [LED-SMD_4P-L3.5-W2.8-BR-1]  33.02 15.88 0 top
LED78  XL-3528RGBW-WS2812B  [LED-SMD_4P-L3.5-W2.8-BR-1]  33.02 19.69 0 top
LED79  XL-3528RGBW-WS2812B  [LED-SMD_4P-L3.5-W2.8-BR-1]  32.89 23.37 0 top
LED80  XL-3528RGBW-WS2812B  [LED-SMD_4P-L3.5-W2.8-BR-1]  32.89 27.31 0 top
NOREF  -  [Pad_e8254]  65.4 3.69 0 top
NOREF#2  -  [Pad_e8253]  87.12 3.69 0 top
NOREF#3  -  [Pad_e8252]  87.5 28.2 0 top
NOREF#4  -  [Pad_e11532]  11.05 3.69 0 top
NOREF#5  -  [Pad_e10487]  8.89 30.36 0 top
NOREF#6  -  [Pad_e10486]  26.03 30.36 0 top
NOREF#7  -  [Pad_e10496]  61.63 1.78 0 top
R1  300Ω  [R0603]  68.71 30.1 0 top
R40  10kΩ  [R0603]  68.71 27.43 180 top
R41  10kΩ  [R0603]  51.82 7.24 180 top
R42  10kΩ  [R0603]  50.97 1.18 180 top
U1  2.54-2*5  [hdr-th_10p-p2.54-v-f-r2-c5-s2.54]  53.59 4.19 180 bottom
U2  YTS2S0062BBJ00  [KEY-SMD_L6.0-W6.0-LS6.6]  4.32 3.69 180 top
U3  YTS2S0062BBJ00  [KEY-SMD_L6.0-W6.0-LS6.6]  22.35 3.56 0 top
U4  KH-2.54FH90-1X4P-H8.5  [HDR-TH_4P-P2.54-H-F-W10.2]  88.9 20.45 270 bottom

## Footprints (pads in the part's own frame, mm; a bottom-side part is the same pattern mirrored in y, then rotated)
C0603
  rect 0.8x0.9 smd: 1(-0.7,0) 2(0.7,0)
C1206
  rect 1.485x1.728 smd: 1(-1.593,0) 2(1.593,0)
HDR-TH_4P-P2.54-H-F-W10.2
  round 1.9 hole 1.1: 1(-3.81,0) 2(-1.27,0) 3(1.27,0) 4(3.81,0)
hdr-th_10p-p2.54-v-f-r2-c5-s2.54
  rect 1.575x1.7 hole 1.1: 1(-5.08,-1.27)
  rect 1.7x1.7 hole 1.1: 2(-5.08,1.27)
  round 1.7 hole 1.1: 3(-2.54,-1.27) 4(-2.54,1.27) 5(0,-1.27) 6(0,1.27) 7(2.54,-1.27) 8(2.54,1.27) 9(5.08,-1.27) 10(5.08,1.27)
KEY-SMD_L6.0-W6.0-LS6.6
  rect 2x2 smd: 1(-3,0) 2(3,0)
LED-SMD_4P-L3.5-W2.8-BR-1
  rect 1.2x0.9 smd: 1(1.5,-0.75) 2(1.5,0.75) 3(-1.5,0.75) 4(-1.5,-0.75)
Pad_e8252
  round 5 hole 3: 1(0,0)
Pad_e8253
  round 5 hole 3: 1(0,0)
Pad_e8254
  round 5 hole 3: 1(0,0)
Pad_e10486
  round 1.524 hole 0.914: 1(0,0)
Pad_e10487
  round 1.524 hole 0.914: 2(0,0)
Pad_e10496
  round 1.524 hole 0.914: 3(0,0)
Pad_e11532
  round 5 hole 3: 1(0,0)
R0603
  rect 0.806x0.864 smd: 1(-0.753,0) 2(0.753,0)

## Nets
As in the schematic, except:
GND: C17.1 C18.1 C20.2 C21.2 C22.1 C23.1 C24.1 C25.1 LED16.1 LED17.1 LED18.1 LED19.1 LED20.1 LED21.1 LED22.1 LED23.1 LED24.1 LED25.1 LED26.1 LED27.1 LED28.1 LED29.1 LED30.1 LED31.1 LED32.1 LED33.1 LED34.1 LED35.1 LED36.1 LED37.1 LED38.1 LED39.1 LED40.1 LED41.1 LED42.1 LED43.1 LED44.1 LED45.1 LED46.1 LED47.1 LED48.1 LED49.1 LED50.1 LED51.1 LED52.1 LED53.1 LED54.1 LED55.1 LED56.1 LED57.1 LED58.1 LED59.1 LED60.1 LED61.1 LED62.1 LED63.1 LED64.1 LED65.1 LED66.1 LED67.1 LED68.1 LED69.1 LED70.1 LED71.1 LED72.1 LED73.1 LED74.1 LED75.1 LED76.1 LED77.1 LED78.1 LED79.1 LED80.1 NOREF.1 NOREF#2.1 NOREF#3.1 NOREF#4.1 NOREF#5.2 NOREF#6.1 R40.2 U1.1 U1.2 U2.1 U3.1 U4.4
OUT3: NOREF#7.3 U1.3

## Via types
v1: diameter 0.61, hole 0.305, Top Layer to Bottom Layer, 137 vias

## Routing (per net, layer and track width the routed paths; a pad name or vN(x,y) marks a point on that pad's centre or on a via; arc(x,y) is an arc through that point)
+5V: length 321.9
  Top Layer w0.4: 89.41,19.18 87.76,19.18 86.74,20.2 86.74,24.01 82.42,28.32 75.06,28.32 v1(74.42,28.96)
  Top Layer w1: 31.5,29.78 31.5,28.16 v1(31.39,28.06) ; 16.64,29.78 16.64,28.3 v1(16.35,28.01) ; v1(52.21,27.95) 52.26,28 C21.1 ; v1(1.28,28.01) 1.52,28.25 1.52,29.65 ; v1(36.59,28.01) 36.83,28.26 36.83,29.78 ; C18.2 48.33,2.73 U1.9
  Bottom Layer w0.4: v1(62.34,27.95) 62.34,28.31 64.14,30.1 73.28,30.1 v1(74.42,28.96)
  Bottom Layer w1: v1(6.35,12.79) v1(6.35,16.6) v1(6.35,20.4) v1(6.35,24.21) v1(6.35,28.01) ; v1(26.47,28.01) 31.44,28.01 ; v1(26.47,28.01) v1(21.41,28.01) ; v1(26.47,28.01) v1(26.47,20.4) v1(26.47,16.6) v1(26.47,12.79) 26.47,10.76 ; 31.44,28.01 v1(36.59,28.01) ; 31.44,28.01 v1(31.39,28.06) ; 31.44,28.01 31.52,27.93 v1(31.52,20.44) v1(31.52,16.63) v1(31.52,12.82) ; v1(62.34,12.73) v1(62.34,16.54) v1(62.34,20.34) v1(62.34,27.95) 62.28,28.01 v1(46.71,28.01) v1(41.65,28.01) ; 46.71,14.82 v1(46.71,16.6) v1(46.71,20.4) 46.71,27.43 ; v1(41.65,12.79) v1(41.65,16.6) v1(41.65,20.4) v1(41.65,24.21) v1(41.65,28.01) ; v1(52.21,27.95) 52.2,27.94 v1(52.2,12.77) ; 36.57,10.42 v1(36.57,12.83) 36.57,28 v1(36.59,28.01) ; v1(57.28,12.73) v1(57.28,16.54) v1(57.28,20.34) v1(57.28,24.15) v1(57.28,27.95) ; v1(11.41,28.01) v1(16.35,28.01) ; v1(11.41,28.01) v1(11.41,20.4) v1(11.41,16.6) v1(11.41,12.79) 11.41,10.63 ; v1(11.41,28.01) v1(6.35,28.01) ; v1(16.35,28.01) v1(21.41,28.01) ; v1(16.35,28.01) v1(16.35,24.21) v1(16.35,20.4) v1(16.35,16.6) 16.35,12.84 v1(16.33,12.83) ; v1(36.59,28.01) v1(41.65,28.01) ; v1(1.27,12.83) 1.27,28 v1(1.28,28.01) v1(6.35,28.01) ; 46.71,14.69 v1(46.71,12.79) 46.71,3.83 47.62,2.92 U1.9 ; v1(21.41,28.01) v1(21.41,24.21) v1(21.41,20.4) v1(21.41,16.6) v1(21.41,12.79)
  vias: v1(1.28,24.21) v1(1.28,20.4) v1(1.28,16.6) v1(11.43,24.26) v1(26.49,24.26) v1(31.37,24.13) v1(36.59,24.21) v1(36.59,20.4) v1(36.59,16.6) v1(46.73,24.26) v1(52.21,24.15) v1(52.21,20.34) v1(52.21,16.54) v1(62.36,24.2)
GND: length 5.1
  Top Layer w0.256: U2.1 NOREF#4.1
  Bottom Layer w0.256: 88.65,17.66 89.41,16.89 89.41,16.64
  vias: v1(4.28,26.51) v1(4.28,22.71) v1(4.28,18.9) v1(4.28,15.1) v1(4.28,11.29) v1(9.35,26.51) v1(9.35,22.71) v1(9.35,18.9) v1(9.35,15.1) v1(9.35,11.29) v1(14.41,26.51) v1(14.41,22.71) v1(14.41,18.9) v1(14.41,15.1) v1(14.41,11.29) v1(19.35,26.51) v1(19.35,22.71) v1(19.35,18.9) v1(19.35,15.1) v1(19.35,11.29) v1(24.13,1.15) v1(24.41,26.51) v1(24.41,22.71) v1(24.41,18.9) v1(24.41,15.1) v1(24.41,11.29) v1(29.47,26.51) v1(29.47,22.71) v1(29.47,18.9) v1(29.47,15.1) v1(29.47,11.29) v1(34.39,26.56) v1(34.39,22.75) v1(34.39,18.95) v1(34.39,15.14) v1(34.39,11.34) v1(39.46,26.56) v1(39.46,22.75) v1(39.46,18.95) v1(39.46,15.14) v1(39.46,11.34) v1(44.52,26.56) v1(44.52,22.75) v1(44.52,18.95) v1(44.52,15.14) v1(44.52,11.34) v1(49.71,26.51) v1(49.71,22.71) v1(49.71,18.9) v1(49.71,15.1) v1(49.71,11.29) v1(55.21,26.45) v1(55.21,22.65) v1(55.21,18.84) v1(55.21,15.04) v1(55.21,11.23) v1(60.28,26.45) v1(60.28,22.65) v1(60.28,18.84) v1(60.28,15.04) v1(60.28,11.23) v1(65.34,26.45) v1(65.34,22.65) v1(65.34,18.84) v1(65.34,15.04) v1(65.34,11.23) v1(71.37,29.09)
VCC3.3OUT: length 13.7
  Top Layer w0.4: U1.10 49.78,4.19 49.78,1.61 R42.2 ; 48.96,5.91 50.29,7.24 R41.2
  Top Layer w1: C20.1 48.96,5.91 U1.10 ; U1.10 48.38,5.59 47.81,5.59 ; U1.10 47.94,5.46 47.81,5.59 ; 47.81,5.59 C17.2
DIGIT0_OUT: length 18.1
  Top Layer w0.254: LED31.2 50.22,28.01 50.93,27.31 50.93,12.52 LED28.4
DIGIT1_OUT: length 2.7
  Top Layer w0.254: LED76.2 36.05,11.29 LED43.4
DIGIT2_OUT: length 17.7
  Top Layer w0.254: LED58.4 16.02,11.29 15.37,11.94 15.37,27.06 LED61.2
OUT1: length 52.3
  Bottom Layer w0.256: U1.7 49.7,1.57 30.13,1.57 29.41,2.29 23.22,2.29 21.7,0.76 9.4,0.76 6.6,3.56 v1(1.4,3.56)
OUT2: length 31
  Top Layer w0.8: U3.2 25.35,1.98 v1(26.34,0.98)
  Bottom Layer w0.256: v1(26.34,0.98) 51.65,0.98 U1.5
OUT3: length 6.9
  Top Layer w0.4: U1.3 56.13,2.16 57.28,1.02 60.83,1.02 61.34,1.53 61.34,1.78
OUT4: length 35.6
  Top Layer w0.8: R1.2 69.46,28.7 ; R40.1 69.46,28.7 v1(69.47,28.7)
  Bottom Layer w0.256: v1(69.47,28.7) 66.55,28.7 64.14,26.29 64.14,9.27 62.36,7.5 58.17,7.5 U1.4
OUT5: length 58.7
  Top Layer w0.4: U1.6 53.59,6.22 R41.1
  Bottom Layer w0.256: 89.41,24.26 86.11,24.26 82.93,27.43 67.69,27.43 64.64,24.39 64.64,8.77 ; U1.6 53.59,5.21 54.61,4.19 60.2,4.19 64.64,8.64
OUT6: length 62.5
  Top Layer w0.256: 52.32,4.19 61.47,4.19 64.52,7.24 v1(66.93,7.24) ; 52.32,4.19 52.32,1.78 51.72,1.18 ; 52.32,4.19 U1.8
  Bottom Layer w0.256: 66.04,21.08 71.12,26.16 82.42,26.16 86.87,21.72 89.41,21.72 ; 66.04,21.08 66.04,21.21 ; 66.04,21.08 66.04,10.42 ; 66.04,10.29 66.93,9.4 v1(66.93,7.24)
SEP_OUT: length 2.5
  Top Layer w0.254: LED46.2 29.94,28.01 LED80.4
$1N492: length 2.6
  Top Layer w0.254: LED17.2 60.64,27.95 62.03,26.56 LED16.4
$1N566: length 2.7
  Top Layer w0.254: LED18.2 56.71,26.45 LED17.4
$1N842: length 2.7
  Top Layer w0.254: LED21.4 60.84,24.15 LED20.2
$1N846: length 2.7
  Top Layer w0.254: LED20.4 55.78,24.15 LED19.2
$1N1059: length 2.7
  Top Layer w0.254: LED23.2 61.78,18.84 LED24.4
$1N1063: length 2.7
  Top Layer w0.254: LED23.4 55.78,20.34 LED22.2
$1N1276: length 2.7
  Top Layer w0.254: LED26.2 60.84,16.54 LED27.4
$1N1280: length 2.7
  Top Layer w0.254: LED25.2 56.71,15.04 LED26.4
$1N1499: length 2.7
  Top Layer w0.254: LED29.2 60.84,12.73 LED30.4
$1N1503: length 2.7
  Top Layer w0.254: LED28.2 55.78,12.73 LED29.4
$1N1526: length 14.1
  Top Layer w0.254: LED21.2 64.09,25.4 53.26,25.4 LED18.4
$1N1531: length 14.1
  Top Layer w0.254: LED24.2 65.13,20.34 63.88,21.59 53.27,21.59 LED19.4
$1N1536: length 14.3
  Top Layer w0.254: LED22.4 53.15,17.91 64.26,17.91 65.34,16.83 LED27.2
$1N1541: length 14.1
  Top Layer w0.254: LED25.4 53.28,13.97 63.88,13.97 65.12,12.73 LED30.2
$1N5237: length 3.5
  Top Layer w0.4: R1.1 67.3,30.1 LED16.2
$1N7053: length 2.7
  Top Layer w0.254: LED31.4 45.21,28.01 LED32.2
$1N7057: length 2.7
  Top Layer w0.254: LED33.2 40.15,28.01 LED32.4
$1N7061: length 2.7
  Top Layer w0.254: LED35.2 45.21,24.21 LED36.4
$1N7065: length 2.7
  Top Layer w0.254: LED34.2 40.15,24.21 LED35.4
$1N7069: length 2.7
  Top Layer w0.254: LED39.4 45.21,20.4 LED38.2
$1N7073: length 2.7
  Top Layer w0.254: LED38.4 40.15,20.4 LED37.2
$1N7077: length 2.7
  Top Layer w0.254: LED41.2 45.21,16.6 LED42.4
$1N7081: length 2.7
  Top Layer w0.254: LED41.4 40.15,16.6 LED40.2
$1N7085: length 2.7
  Top Layer w0.254: LED44.2 46.15,11.29 LED45.4
$1N7089: length 2.7
  Top Layer w0.254: LED43.2 40.15,12.79 LED44.4
$1N7093: length 14.1
  Top Layer w0.254: LED36.2 48.52,25.4 37.7,25.4 LED33.4
$1N7097: length 14.1
  Top Layer w0.254: LED39.2 48.65,21.47 37.83,21.47 LED34.4
$1N7101: length 14.4
  Top Layer w0.254: LED37.4 37.71,17.78 49.15,17.78 49.71,17.22 LED42.2
$1N7105: length 14.3
  Top Layer w0.254: LED45.2 49.28,13.23 49.28,13.59 48.77,14.1 37.58,14.1 LED40.4
$1N8208: length 2.7
  Top Layer w0.254: LED47.2 24.96,28.01 LED46.4
$1N8212: length 2.7
  Top Layer w0.254: LED47.4 19.91,28.01 LED48.2
$1N8216: length 2.7
  Top Layer w0.254: LED50.2 24.96,24.21 LED51.4
$1N8220: length 2.7
  Top Layer w0.254: LED50.4 19.91,24.21 LED49.2
$1N8224: length 2.7
  Top Layer w0.254: LED53.2 24.96,20.4 LED54.4
$1N8228: length 2.7
  Top Layer w0.254: LED53.4 20.85,18.9 LED52.2
$1N8232: length 2.7
  Top Layer w0.254: LED57.4 26.31,15.24 25.77,15.24 LED56.2
$1N8236: length 2.7
  Top Layer w0.254: LED56.4 19.91,16.6 LED55.2
$1N8240: length 2.7
  Top Layer w0.254: LED60.4 24.96,12.79 LED59.2
$1N8244: length 2.7
  Top Layer w0.254: LED58.2 19.91,12.79 LED59.4
$1N8248: length 14.1
  Top Layer w0.254: LED48.4 17.46,25.4 27.5,25.4 28.7,24.21 LED51.2
$1N8252: length 14.1
  Top Layer w0.254: LED54.2 28.27,21.59 17.46,21.59 LED49.4
$1N8256: length 14.1
  Top Layer w0.254: LED52.4 17.47,17.78 28.27,17.78 LED57.2
$1N8260: length 14.1
  Top Layer w0.254: LED60.2 28.28,13.97 17.47,13.97 LED55.4
$1N9308: length 2.7
  Top Layer w0.254: LED61.4 10.85,26.51 LED62.2
$1N9312: length 1.9
  Top Layer w0.254: 5.71,26.8 5.5,26.8 LED63.2
$1N9316: length 2.7
  Top Layer w0.254: LED65.2 9.91,24.21 LED66.4
$1N9320: length 2.7
  Top Layer w0.254: LED64.2 4.85,24.21 LED65.4
$1N9324: length 2.7
  Top Layer w0.254: LED68.2 9.91,20.4 LED69.4
$1N9328: length 2.7
  Top Layer w0.254: LED67.2 4.85,20.4 LED68.4
$1N9332: length 2.7
  Top Layer w0.254: LED72.4 9.91,16.6 LED71.2
$1N9336: length 2.7
  Top Layer w0.254: LED71.4 4.85,16.6 LED70.2
$1N9340: length 2.7
  Top Layer w0.254: LED75.4 9.91,12.79 LED74.2
$1N9344: length 2.7
  Top Layer w0.254: LED73.2 5.78,11.29 LED74.4
$1N9348: length 14.2
  Top Layer w0.254: LED63.4 2.52,25.28 13.59,25.28 14.41,24.45 LED66.2
$1N9352: length 14.1
  Top Layer w0.254: LED69.2 13.35,21.47 2.52,21.47 LED64.4
$1N9356: length 14.1
  Top Layer w0.254: LED67.4 2.53,17.66 13.46,17.66 14.41,16.71 LED72.2
$1N9360: length 14.3
  Top Layer w0.254: LED70.4 2.41,13.97 13.59,13.97 14.41,13.15 LED75.2
$1N9683: length 6.6
  Top Layer w0.254: LED76.4 32.89,12.69 32.89,15 LED77.2
$1N9693: length 6.6
  Top Layer w0.254: LED77.4 32.89,16.5 32.89,18.93 34.4,20.44 LED78.2
$1N9887: length 6.6
  Top Layer w0.254: LED79.2 34.02,24.12 32.89,22.99 32.89,20.31 LED78.4
$1N9959: length 7
  Top Layer w0.254: LED79.4 32.89,24.12 32.89,27.05 33.9,28.06 LED80.2

## Copper pours and planes (outline as drawn; the poured copper is in the pictures)
GND on Top Layer: -3.05,34.67 92.96,34.67 92.96,-0.63 -3.05,-0.63
GND on Bottom Layer: -4.06,36.83 91.31,36.83 91.31,-0.25 -4.06,-0.25

## Text on the board
Top Silkscreen Layer: SDA | SCL | 5V | GND | Esp-Wake / Grid Frontend
